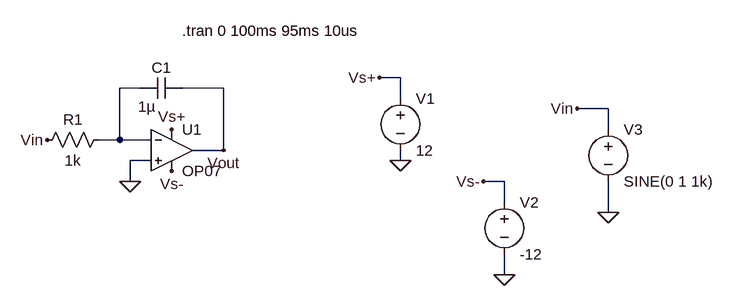
[diagram p0: schematic Task04 Integrator.asc]
Task04 Integrator.asc, the LTspice schematic file:
Version 4
SHEET 1 880 680
WIRE 192 -16 160 -16
WIRE -208 0 -240 0
WIRE -80 0 -144 0
WIRE 192 16 192 -16
WIRE 512 32 464 32
WIRE 512 64 512 32
WIRE -240 80 -240 0
WIRE -240 80 -272 80
WIRE -192 80 -240 80
WIRE -80 96 -80 0
WIRE -80 96 -128 96
WIRE -192 112 -224 112
WIRE 192 112 192 96
WIRE -224 144 -224 112
WIRE 352 144 320 144
WIRE 352 176 352 144
WIRE 512 192 512 144
WIRE 352 288 352 256
FLAG -224 144 0
FLAG -352 80 Vin
FLAG -160 64 Vs+
FLAG -160 128 Vs-
FLAG 192 112 0
FLAG 352 288 0
FLAG 512 192 0
FLAG 160 -16 Vs+
FLAG 464 32 Vin
FLAG 320 144 Vs-
FLAG -80 96 Vout
SYMBOL OpAmps\\OP07 -160 32 R0
SYMATTR InstName U1
SYMBOL voltage 192 0 R0
SYMATTR InstName V1
SYMATTR Value 12
SYMBOL voltage 352 160 R0
SYMATTR InstName V2
SYMATTR Value -12
SYMBOL voltage 512 48 R0
WINDOW 123 0 0 Left 0
WINDOW 39 0 0 Left 0
SYMATTR InstName V3
SYMATTR Value SINE(0 1 1k)
SYMBOL res -368 96 R270
WINDOW 0 32 56 VTop 2
WINDOW 3 0 56 VBottom 2
SYMATTR InstName R1
SYMATTR Value 1k
SYMBOL cap -208 16 R270
WINDOW 0 32 32 VTop 2
WINDOW 3 3 10 VBottom 2
SYMATTR InstName C1
SYMATTR Value 1µ
TEXT -144 -88 Left 2 !.tran 0 100ms 95ms 10us

The netlist it stands for:
* Task04 Integrator.asc
XU1 0 N001 Vs+ Vs- Vout LT1001  ; OP07, pins In+ In- V+ V- OUT
V1 Vs+ 0 12
V2 Vs- 0 -12
V3 Vin 0 SINE(0 1 1k)
R1 Vin N001 1k
C1 N001 Vout 1µ
.tran 0 100ms 95ms 10us
.lib LTC.lib
.backanno
.end

* Results of the author's LTspice run, read from the files saved beside the schematic
* Operating Point, zero values left out:
*   V(vs+) = 12 V
*   V(vs-) = -12 V
*   I(V2) = 2.25 mA
*   I(V1) = -2.25 mA
*   Ix(u1:3) = 2.25 mA
*   Ix(u1:4) = -2.25 mA
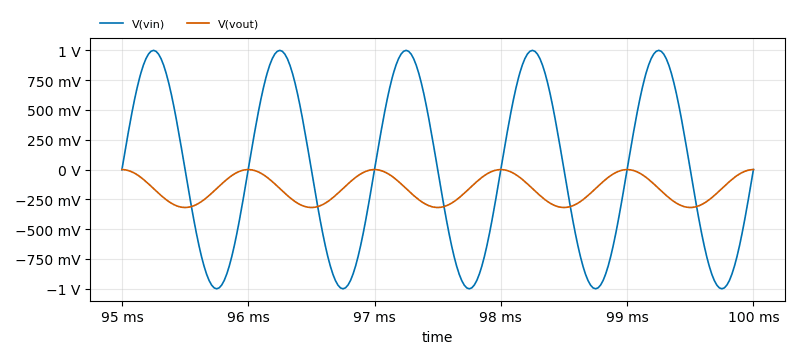
[diagram p1: Transient Analysis of Task04 Integrator.asc, plotted from the saved traces]
* Transient Analysis, 1 run:
*   V(vin): min -1 V, max 1 V, average 771.8 nV, rms 706.9 mV, last 0 V
*   V(vout): min -317.7 mV, max 60.11 µV, average -159 mV, rms 194.7 mV, last 60.11 µV